# EasyEDA schematic SCH_TESIS_2025-11-20_FINALV2.json

## Sheets
1 Sheet_1: TITLE: ESQUEMATICO DEL ASISTENTE; REV: 1.0; Date: 2025-09-09; Sheet: 1/1; Drawn By: a20195821; Company: RICARDO AMAYA
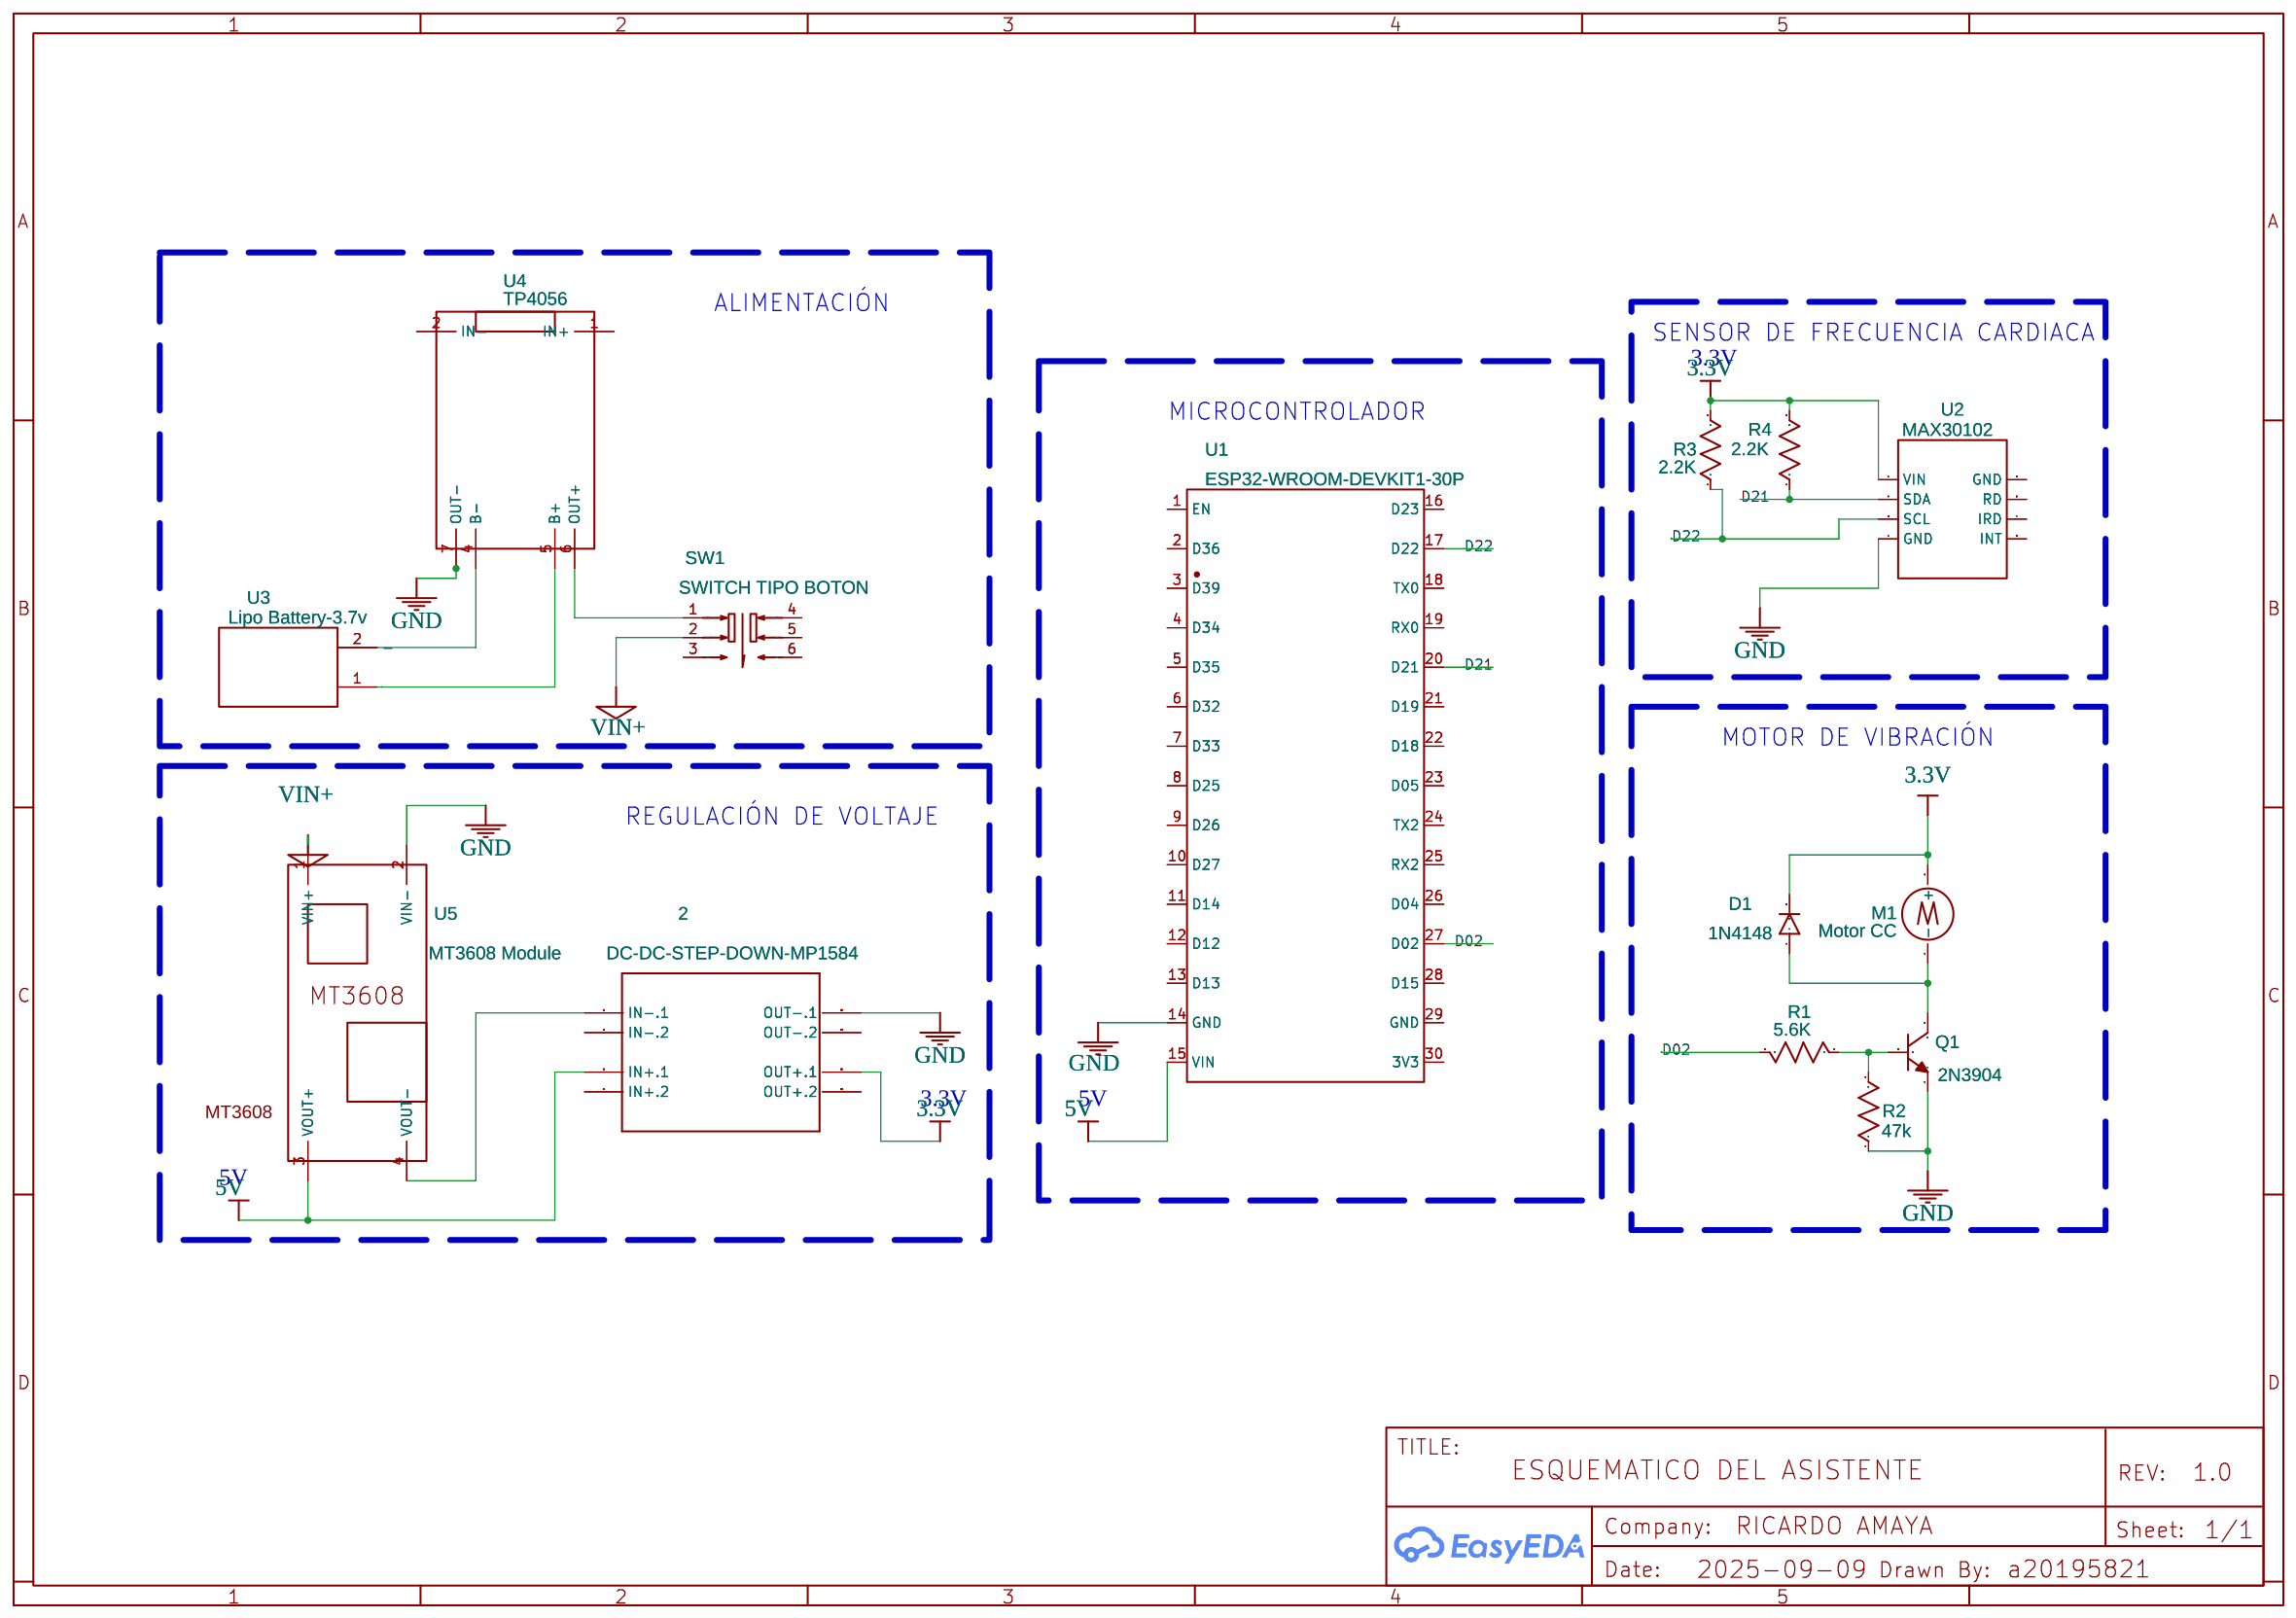
[diagram p0: Sheet_1]
2 Sheet_2: TITLE: Sheet_2; Date: 2025-10-06; Company: Your Company
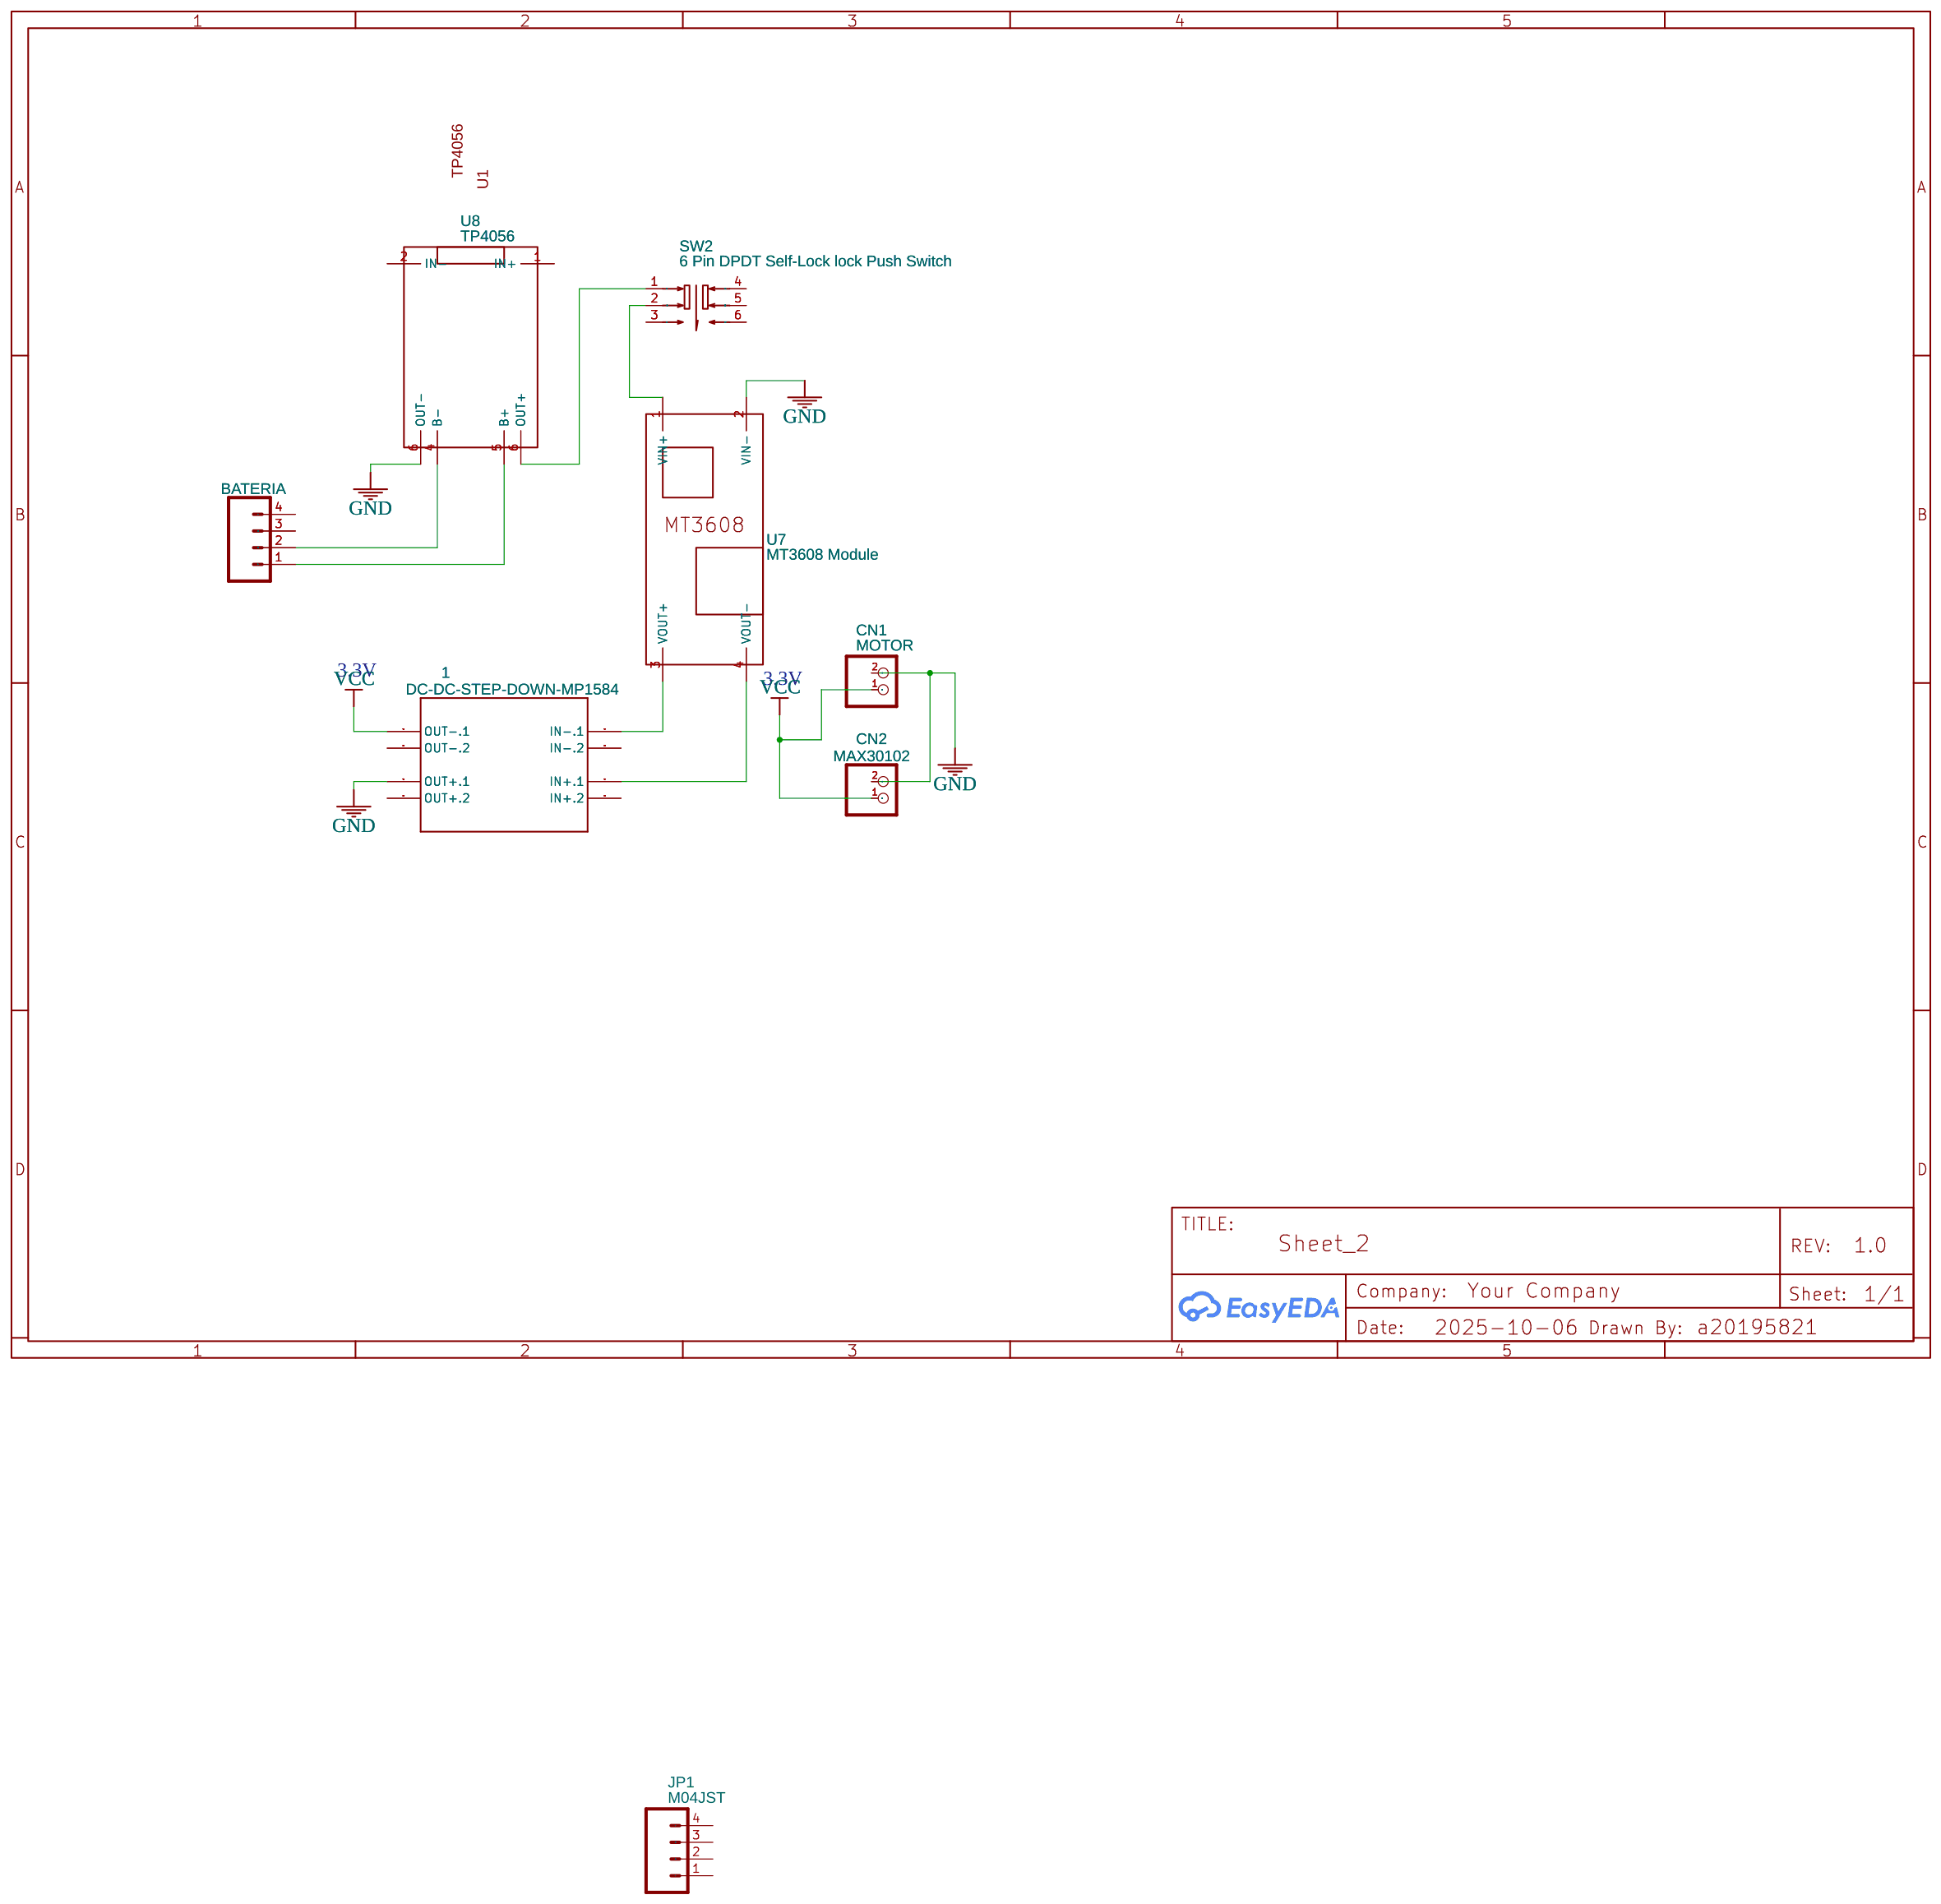
[diagram p1: Sheet_2]
3 Sheet_3: TITLE: Sheet_1; Company: Your Company
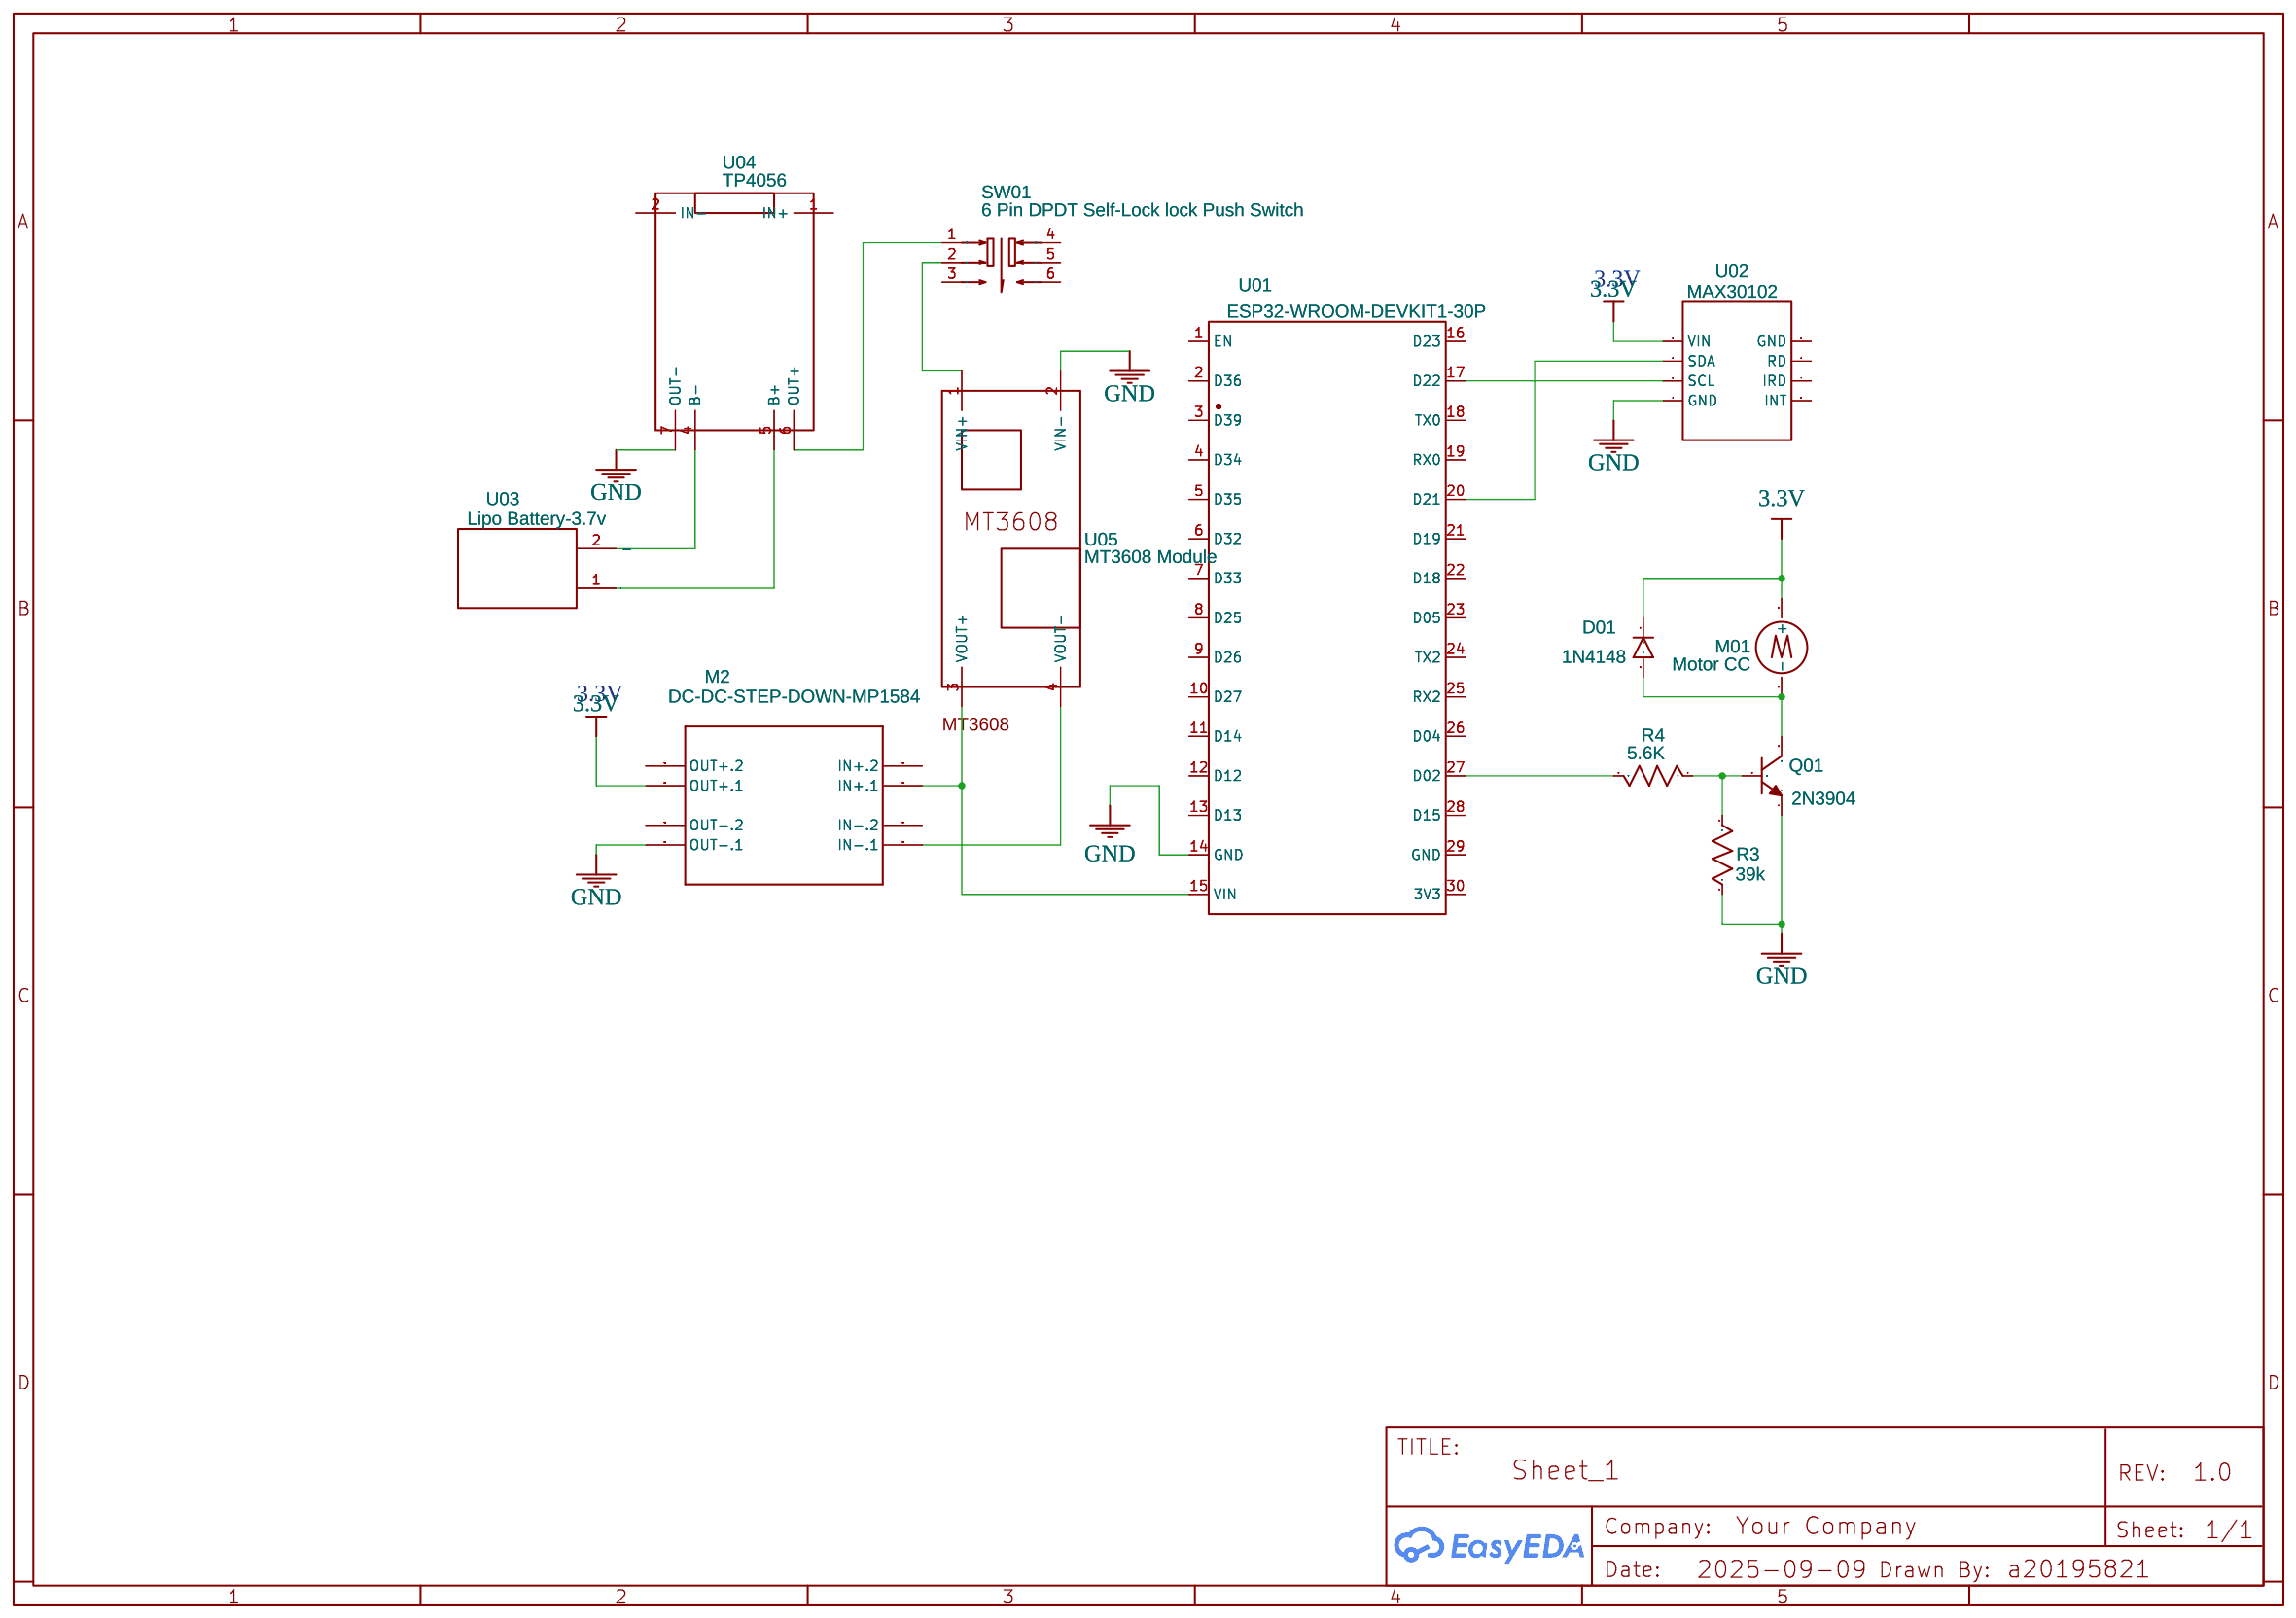
[diagram p2: Sheet_3]

## Parts
sheet Sheet_1
2  DC-DC-STEP-DOWN-MP1584  [DC-DC-STEP-DOWN-MP1584]
D1  1N4148  [1N4148_1N4148W]
M1  Motor CC  [VIBRATION MOTOR - 3V COIN TYPE VIBRATION MOTOR 10000RPM]
Q1  2N3904  [SOT-23-3_L2.9-W1.3-P1.90-LS2.4-TR]
R1  5.6K  [R0603]
R2  47k  [R0603]
R3  2.2K  [R0603]
R4  2.2K  [R0603]
SW1  SWITCH TIPO BOTON  [6 PIN DPDT PUSH SWITCH]
U1  ESP32-WROOM-DEVKIT1-30P  [ESP32-WROOM-DEVKIT1-30P]
U2  MAX30102  [MAX30102]
U3  Lipo Battery-3.7v  [LIPO BATTERY-3.7V]
U4  TP4056  [TP4056]
U5  MT3608 Module  [MT3608]
sheet Sheet_2
1  DC-DC-STEP-DOWN-MP1584  [DC-DC-STEP-DOWN-MP1584]
BATERIA  M04JST  [1X04-1.5MM_JST]
CN1  MOTOR  [JST-PH-2-THM]
CN2  MAX30102  [JST-PH-2-THM]
JP1  M04JST  [1X04-1.5MM_JST]
SW2  6 Pin DPDT Self-Lock lock Push Switch  [6 PIN DPDT PUSH SWITCH]
U7  MT3608 Module  [MT3608_V2]
U8  TP4056  [TP4056]
sheet Sheet_3
D01  1N4148  [1N4148_1N4148W]
M01  Motor CC  [VIBRATION MOTOR - 3V COIN TYPE VIBRATION MOTOR 10000RPM]
M2  DC-DC-STEP-DOWN-MP1584  [DC-DC-STEP-DOWN-MP1584]
Q01  2N3904  [2N3904TO-92]
R3#2  39k  [R0603]
R4#2  5.6K  [R0603]
SW01  6 Pin DPDT Self-Lock lock Push Switch  [6 PIN DPDT PUSH SWITCH]
U01  ESP32-WROOM-DEVKIT1-30P  [ESP32-WROOM-DEVKIT1-30P]
U02  MAX30102  [MAX30102]
U03  Lipo Battery-3.7v  [LIPO BATTERY-3.7V]
U04  TP4056  [TP4056]
U05  MT3608 Module  [MT3608]

## Library data of the parts
1 2 M2 = DC-DC-STEP-DOWN-MP1584: Contributor: Lucky1023
D1 D01 = 1N4148: Contributor: ANDRE39
M1 M01 = Motor CC: JLCPCB Part Class: Extended Part; Contributor: maria.p08
Q1 Q01 = 2N3904(SOT-23): Supplier: LCSC; Manufacturer: KEC; Manufacturer Part: 2n3904S-RTK/PS; Supplier Part: C18536; Paste Type: SOT-23; Contributor: LCEDA_Lib
R1-R3 R3#2 R4 R4#2 = R_0603_US: Contributor: LCEDA_Lib
SW1 SW01 SW2 = 6 Pin DPDT Self-Lock lock Push Switch: Manufacturer: MAHA; Contributor: alif2030
U1 U01 = ESP32-WROOM-DEVKIT1-30P: Contributor: viktor.g.stamenov
U2 U02 = MAX30102: Contributor: ubayd2947
U3 U03 = Lipo Battery-3.7v: Contributor: hirukasl6
U4 U04 U8 = TP4056: Contributor: puzrin.pavel
U5 U05 = MT3608 Module: Supplier: Aliexpress; Contributor: Athantos; Package Display: Yes
BATERIA JP1 = M04JST: Header 4; Contributor: SparkFun
CN1 CN2 = JST_2PIN: Contributor: Adafruit
U7 = MT3608 Module: Supplier: Aliexpress; Contributor: Athantos

## Nets
3.3V: 2.OUT+.1 D1.2 D01.2 M1.2(+) M01.2(+) M2.OUT+.1 R3.2 R4.2 U2.1(VIN) U02.1(VIN)
5V: 2.IN+.1 U1.15(VIN) U5.3(VOUT+)
GND: 1.OUT+.1 2.OUT-.1 CN1.2(1) CN2.2(1) M2.OUT-.1 Q1.1(E) Q01.1(E) R2.1 R3#2.1 SW2.1(NC) U1.14(GND) U01.14(GND) U2.4(GND) U02.4(GND) U4.7(OUT-) U04.7(OUT-) U5.2(VIN-) U05.2(VIN-) U7.2(VIN-) U8.6(OUT-)
VCC: 1.OUT-.1 CN1.1(2) CN2.1(2)
VIN+: SW1.2(COM) U5.1(VIN+)
D02: R1.2 U1.27(D02)
D21: R4.1 U1.20(D21) U2.2(SDA)
D22: R3.1 U1.17(D22) U2.3(SCL)
Net-(1-IN+.1): 1.IN+.1 U7.4(VOUT-)
Net-(1-IN-.1): 1.IN-.1 U7.3(VOUT+)
Net-(2-IN-.1): 2.IN-.1 U5.4(VOUT-)
Net-(BATERIA-1): BATERIA.1 U8.5(B+)
Net-(BATERIA-2): BATERIA.2 U8.4(B-)
Net-(D1-1): D1.1 M1.1(-) Q1.3(C)
Net-(D01-1): D01.1 M01.1(-) Q01.3(C)
Net-(M2-IN+.1): M2.IN+.1 U01.15(VIN) U05.3(VOUT+)
Net-(M2-IN-.1): M2.IN-.1 U05.4(VOUT-)
Net-(Q1-2): Q1.2(B) R1.1 R2.2
Net-(Q01-2): Q01.2(B) R3#2.2 R4#2.1
Net-(R4#2-2): R4#2.2 U01.27(D02)
Net-(SW1-1): SW1.1(NC) U4.6(OUT+)
Net-(SW01-1): SW01.1(NC) U04.6(OUT+)
Net-(SW01-2): SW01.2(COM) U05.1(VIN+)
Net-(SW2-2): SW2.2(COM) U7.1(VIN+)
Net-(U01-17): U01.17(D22) U02.3(SCL)
Net-(U01-20): U01.20(D21) U02.2(SDA)
Net-(U3-1): U3.1(+) U4.5(B+)
Net-(U03-1): U03.1(+) U04.5(B+)
Net-(U3-2): U3.2(-) U4.4(B-)
Net-(U03-2): U03.2(-) U04.4(B-)

Not connected (* = marked no-connect by the designer): 1 IN+.2 IN-.2 OUT+.2 OUT-.2; 2 IN+.2 IN-.2 OUT+.2 OUT-.2; BATERIA 3 4; JP1 1 2 3 4; M2 IN+.2 IN-.2 OUT+.2 OUT-.2; SW1 3(NO) 4(NC) 5(COM) 6(NO); SW01 3(NO) 4(NC) 5(COM) 6(NO); SW2 3(NO) 4(NC) 5(COM) 6(NO); U1 1(EN) 2(D36) 3(D39) 4(D34) 5(D35) 6(D32) 7(D33) 8(D25) 9(D26) 10(D27) 11(D14) 12(D12) 13(D13) 16(D23) 18(TX0) 19(RX0) 21(D19) 22(D18) 23(D05) 24(TX2) 25(RX2) 26(D04) 28(D15) 29(GND) 30(3V3); U01 1(EN) 2(D36) 3(D39) 4(D34) 5(D35) 6(D32) 7(D33) 8(D25) 9(D26) 10(D27) 11(D14) 12(D12) 13(D13) 16(D23) 18(TX0) 19(RX0) 21(D19) 22(D18) 23(D05) 24(TX2) 25(RX2) 26(D04) 28(D15) 29(GND) 30(3V3); U2 5(GND) 6(RD) 7(IRD) 8(INT); U02 5(GND) 6(RD) 7(IRD) 8(INT); U4 1(IN+) 2(IN-); U04 1(IN+) 2(IN-); U8 1(IN+) 2(IN-)

## Notes on the sheets
sheet 1
- ALIMENTACIÓN
- SENSOR DE FRECUENCIA CARDIACA
- 3.3V
- MICROCONTROLADOR
- MOTOR DE VIBRACIÓN
- REGULACIÓN DE VOLTAJE
- 3.3V
- 5V
- 5V
sheet 2
- 3.3V
- 3.3V
sheet 3
- 3.3V
- 3.3V
